# EAGLE design avatar2 (EAGLE 7.6.0)
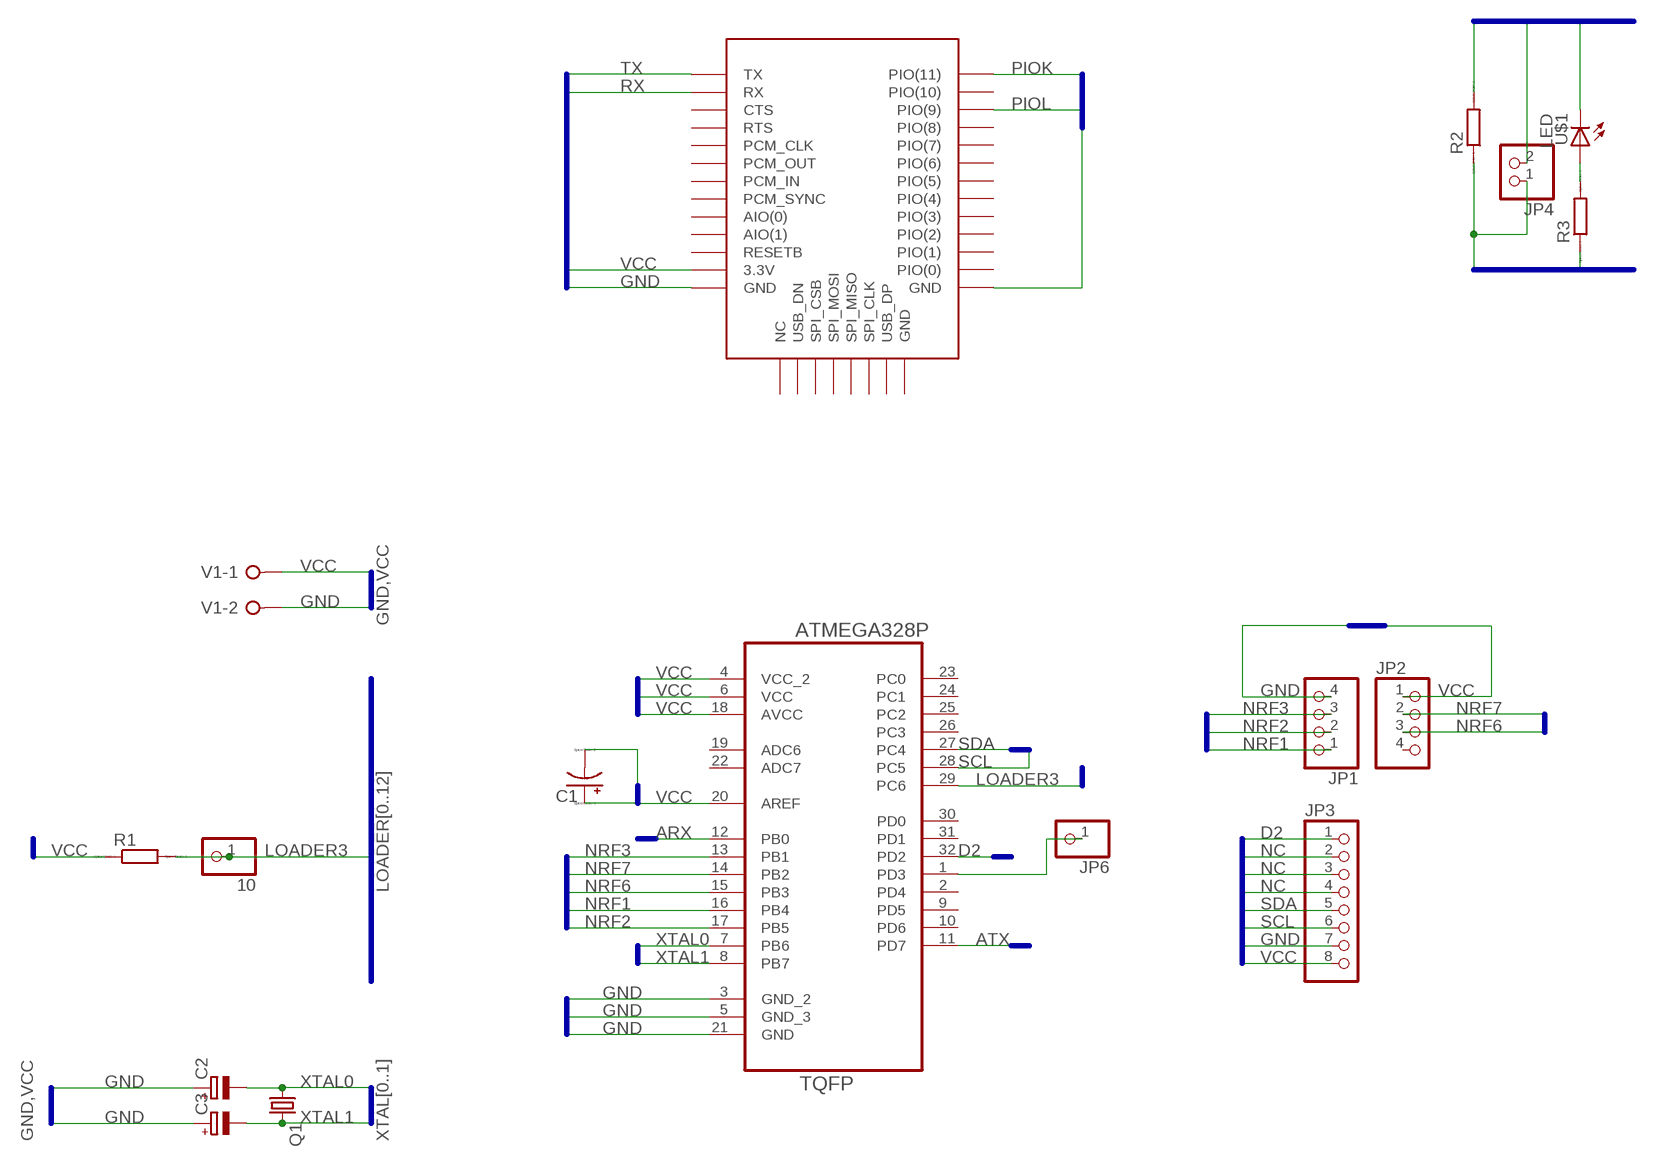
[diagram p0: schematic, sheet 1]

## Parts
10  PINHD-1X1  [1X01]
C1  CPOL-USTT5D7  [TT5D7]
C2  CPOL-EUE1.8-4  [E1,8-4]
C3  CPOL-EUE1.8-4  [E1,8-4]
IC1  BC04_BLUETOOTH  [BC04]
JP1  PINHD-1X4  [1X04]
JP2  PINHD-1X4  [1X04]
JP3  PINHD-1X8  [1X08]
JP4  PINHD-1X2  [1X02]
JP6  PINHD-1X1  [1X01]
Q1  CRYSTALHC49U-V  [HC49U-V]
R1  R0207/10  [0207/10]
R2  R0207/10  [0207/10]
R3  R0207/10  [0207/10]
U1  ATMEGA328P-AU  [QFP80P900X900X120-32N]
U$1  LED  [HLMP-1790]
V1  W237-02P  [W237-132]

## Nets
ARX: U1.12(PB0)
ATX: U1.11(PD7)
D2: JP3.1 U1.32(PD2)
GND: C1.- C2.+ C3.+ IC1.P$13(GND) IC1.P$22(GND) JP1.4 JP3.7 R2.2 U1.3(GND_2) U1.5(GND_3) U1.21(GND) U$1.C V1.2
LOADER3: 10.1 R1.2 U1.29(PC6)
N$1: R3.2 U$1.A
N$2: JP6.1 U1.1(PD3)
NC: JP3.2 JP3.3 JP3.4
NRF1: JP1.1 U1.16(PB4)
NRF2: JP1.2 U1.17(PB5)
NRF3: JP1.3 U1.13(PB1)
NRF6: JP2.3 U1.15(PB3)
NRF7: JP2.2 U1.14(PB2)
PIOK: IC1.P$34(PIO(11)) JP4.1 R2.1
PIOL: IC1.P$32(PIO(9)) R3.1
RX: IC1.P$2(RX)
SCL: JP3.6 U1.28(PC5)
SDA: JP3.5 U1.27(PC4)
TX: IC1.P$1(TX)
VCC: C1.+ IC1.P$12(3.3V) JP2.1 JP3.8 JP4.2 R1.1 U1.4(VCC_2) U1.6(VCC) U1.18(AVCC) U1.20(AREF) V1.1
XTAL0: C2.- Q1.1 U1.7(PB6)
XTAL1: C3.- Q1.2 U1.8(PB7)
Unconnected: IC1.P$3(CTS) IC1.P$4(RTS) IC1.P$5(PCM_CLK) IC1.P$6(PCM_OUT) IC1.P$7(PCM_IN) IC1.P$8(PCM_SYNC) IC1.P$9(AIO(0)) IC1.P$10(AIO(1)) IC1.P$11(RESETB) IC1.P$14(NC) IC1.P$15(USB_DN) IC1.P$16(SPI_CSB) IC1.P$17(SPI_MOSI) IC1.P$18(SPI_MISO) IC1.P$19(SPI_CLK) IC1.P$20(USB_DP) IC1.P$21(GND) IC1.P$23(PIO(0)) IC1.P$24(PIO(1)) IC1.P$25(PIO(2)) IC1.P$26(PIO(3)) IC1.P$27(PIO(4)) IC1.P$28(PIO(5)) IC1.P$29(PIO(6)) IC1.P$30(PIO(7)) IC1.P$31(PIO(8)) IC1.P$33(PIO(10)) JP2.4 U1.2(PD4) U1.9(PD5) U1.10(PD6) U1.19(ADC6) U1.22(ADC7) U1.23(PC0) U1.24(PC1) U1.25(PC2) U1.26(PC3) U1.30(PD0) U1.31(PD1)

## Buses
LOADER[0..12]
GND,VCC
XTAL[0..1]
NRF[1..8]
TX,RX,PIOK,PIOL,VCC,GND
ATX,ARX
D2,NC,SDA,SCL,GND,VCC

## Library data of the parts
10 JP6 = pinhead:PINHD-1X1: PIN HEADER
C1 = resistor:CPOL-US: POLARIZED CAPACITOR, American symbol
C2 C3 = rcl:CPOL-EU: POLARIZED CAPACITOR, European symbol
IC1 = bc04:BC04_BLUETOOTH; IC: BC04
JP1 JP2 = pinhead:PINHD-1X4: PIN HEADER
JP3 = pinhead:PINHD-1X8: PIN HEADER
JP4 = pinhead:PINHD-1X2: PIN HEADER
Q1 = crystal:CRYSTAL: CRYSTAL; OC_FARNELL: 1666969; OC_NEWARK: unknown
R1-R3 = eagle-ltspice:R: RESISTOR, European symbol; SPICEMODEL: NONE; SPICEPREFIX: R
U1 = Ava:ATMEGA328P-AU; DESCRIPTION: 8-bit Microcontroller with In-System Programmable Flash; MPN: ATMEGA328P-AU; OC_FARNELL: 1715486; OC_NEWARK: 14R4631; PACKAGE: TQFP-32; SUPPLIER: Atmel
U$1 = Ava:LED
V1 = con-wago-508:W237-02P: WAGO SREW CLAMP; OC_FARNELL: unknown; OC_NEWARK: unknown

## Board
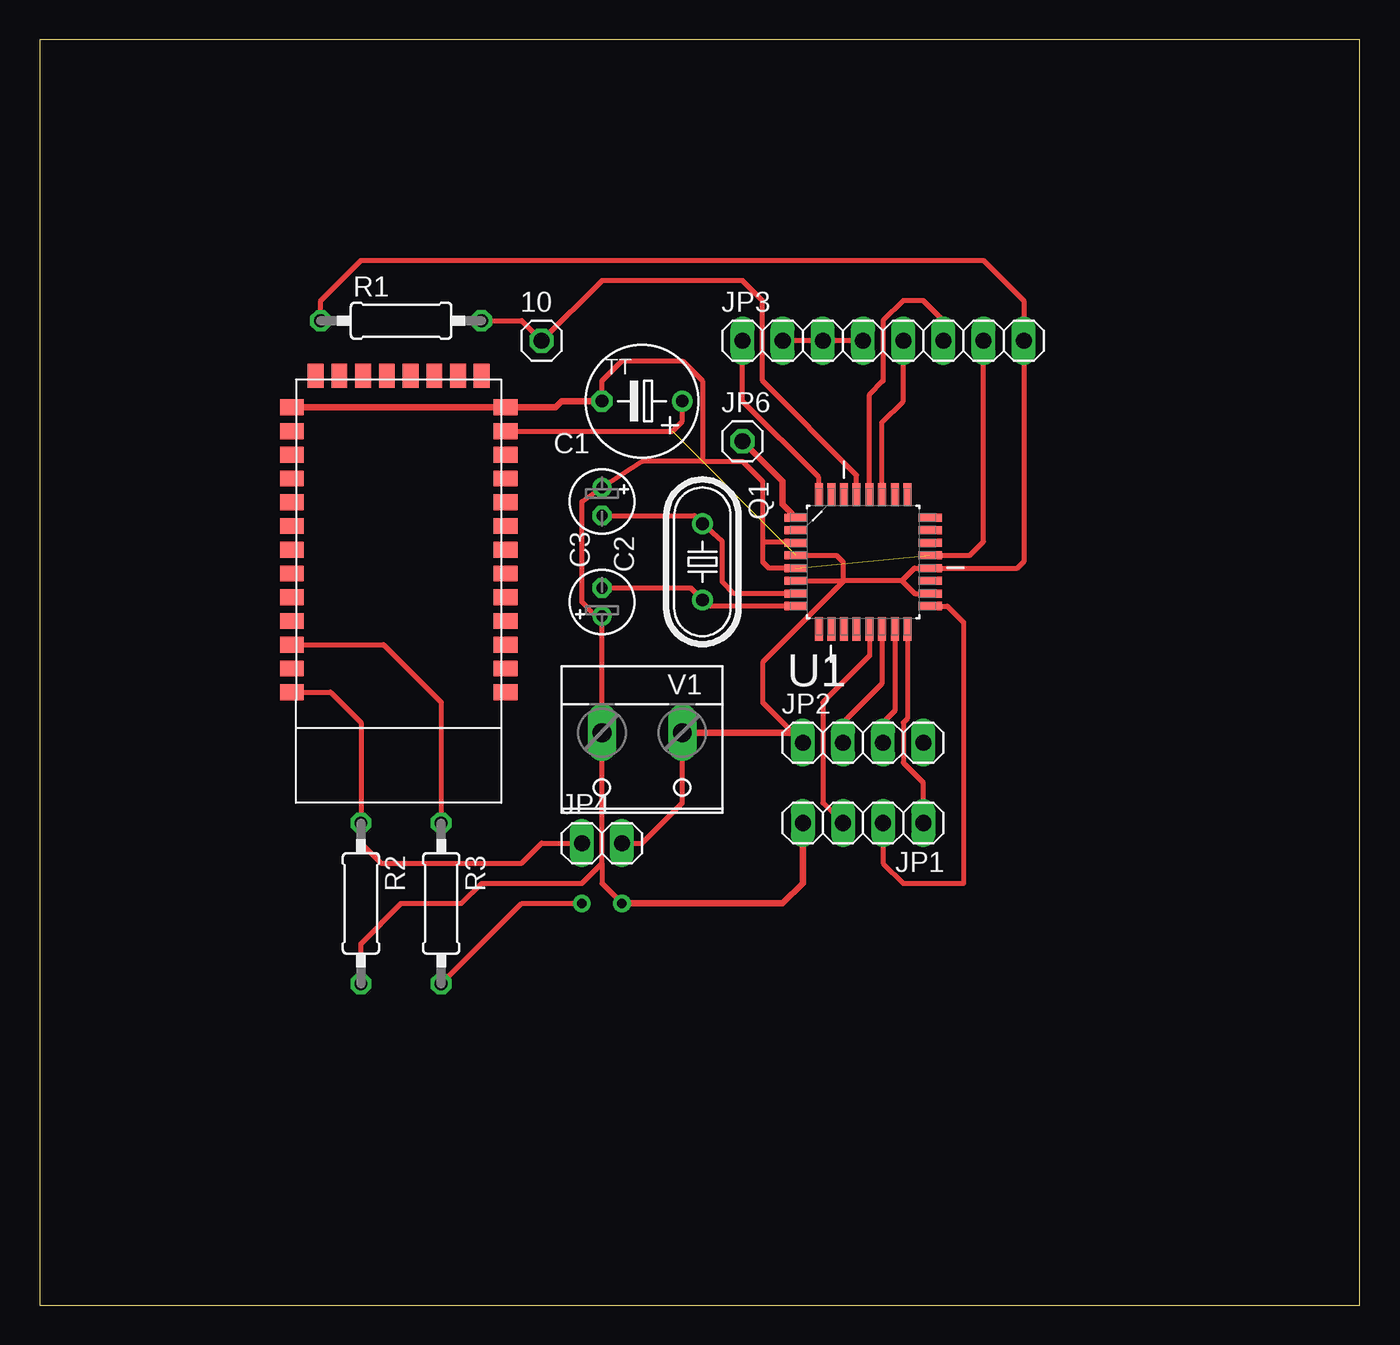
[diagram p1: board, top side]
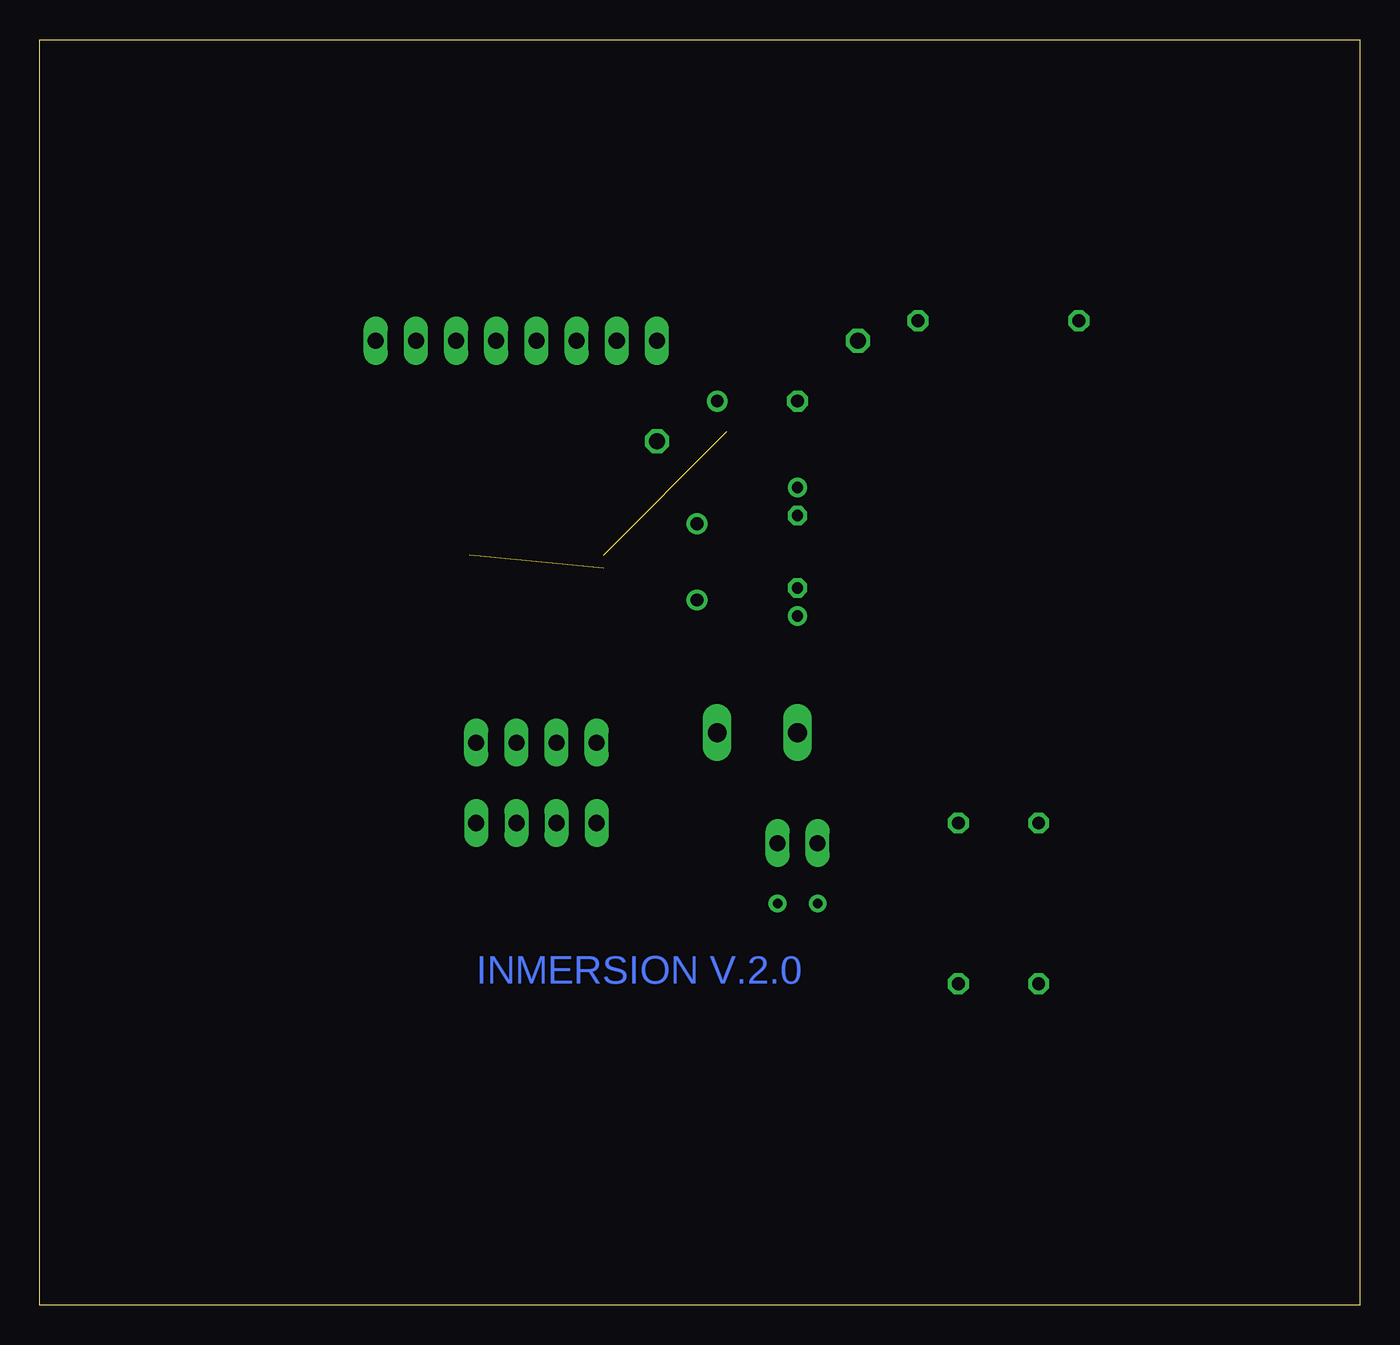
[diagram p2: board, bottom side, seen from below]

Size 83.49 x 80 mm. Coordinates in mm from the lower left corner, seen from the top.
Outline: 0,0 83.49,0 83.49,80 0,80 0,0
Copper layers (1*16): Top 0.035mm / dielectric 1.5mm / Bottom 0.035mm
Design rules "default": minimum track width 10mil, minimum drill 24mil, track to track 8mil, track to pad 8mil, pad to pad 8mil, via to via 8mil, smd to smd 8mil, copper to edge 40mil, drill to drill 8mil, minimum pad ring 10mil, minimum via ring 8mil, stop-mask expansion 4mil, vias tented up to drill 0mil, thermal gap 10mil

### Footprints (pad centres in the part's own frame; a part is rotated, then mirrored left to right if it is on the bottom)
1X01 = drill 1.016 octagon: 1 0,0
TT5D7 = drill 0.813: + -2.54,0 | drill 0.813 octagon: - 2.54,0
E1,8-4 = drill 0.711 pad 1.168: + -0.889,0 | drill 0.711 pad 1.168 octagon: - 0.889,0
BC04 = smd 1 x 1.5: P$1 7,-0.25; P$2 8.5,-0.25; P$3 10,-0.25; P$4 11.5,-0.25; P$5 13,-0.25; P$6 14.5,-0.25; P$7 16,-0.25; P$8 17.5,-0.25; P$9 19,-0.25; P$10 20.5,-0.25; P$11 22,-0.25; P$12 23.5,-0.25; P$13 25,-0.25; P$22 25,13.25; P$23 23.5,13.25; P$24 22,13.25; P$25 20.5,13.25; P$26 19,13.25; P$27 17.5,13.25; P$28 16,13.25; P$29 14.5,13.25; P$30 13,13.25; P$31 11.5,13.25; P$32 10,13.25; P$33 8.5,13.25; P$34 7,13.25 | smd 1.5 x 1: P$14 27,1.25; P$15 27,2.75; P$16 27,4.25; P$17 27,5.75; P$18 27,7.25; P$19 27,8.75; P$20 27,10.25; P$21 27,11.75
1X04 = drill 1.016 long: 1 -3.81,0; 2 -1.27,0; 3 1.27,0; 4 3.81,0
1X08 = drill 1.016 long: 1 -8.89,0; 2 -6.35,0; 3 -3.81,0; 4 -1.27,0; 5 1.27,0; 6 3.81,0; 7 6.35,0; 8 8.89,0
1X02 = drill 1.016 long: 1 -1.27,0; 2 1.27,0
HC49U-V = drill 0.813: 1 -2.413,0; 2 2.413,0
0207/10 = drill 0.813 octagon: 1 -5.08,0; 2 5.08,0
QFP80P900X900X120-32N = smd 1.473 x 0.508: 1 -4.242,2.794; 2 -4.242,2.007; 3 -4.242,1.194; 4 -4.242,0.406; 5 -4.242,-0.406; 6 -4.242,-1.194; 7 -4.242,-2.007; 8 -4.242,-2.794; 17 4.242,-2.794; 18 4.242,-2.007; 19 4.242,-1.194; 20 4.242,-0.406; 21 4.242,0.406; 22 4.242,1.194; 23 4.242,2.007; 24 4.242,2.794 | smd 0.508 x 1.473: 9 -2.794,-4.242; 10 -2.007,-4.242; 11 -1.194,-4.242; 12 -0.406,-4.242; 13 0.406,-4.242; 14 1.194,-4.242; 15 2.007,-4.242; 16 2.794,-4.242; 25 2.794,4.242; 26 2.007,4.242; 27 1.194,4.242; 28 0.406,4.242; 29 -0.406,4.242; 30 -1.194,4.242; 31 -2.007,4.242; 32 -2.794,4.242
HLMP-1790 = drill 0.6: A -1.27,0; C 1.27,0
W237-132 = drill 1.194 long: 1 -2.54,-0.635; 2 2.54,-0.635

### Placement (x,y rotation side)
10  31.75,60.96 0 top
C1  38.1,57.15 180 top
C2  35.56,50.8 270 top
C3  35.56,44.45 90 top
IC1  29.21,31.75 90 top
JP1  52.07,30.48 180 top
JP2  52.07,35.56 0 top
JP3  53.34,60.96 0 top
JP4  35.56,29.21 0 top
JP6  44.45,54.61 0 top
Q1  41.91,46.99 270 top
R1  22.86,62.23 0 top
R2  20.32,25.4 270 top
R3  25.4,25.4 270 top
U1  52.07,46.99 0 top
U$1  35.56,25.4 0 top
V1  38.1,35.56 180 top

### Tracks (layer width: path | path; a pad name or v marks a point on that pad's centre or on a via)
D2
  Top 0.305: U1.32 49.28,52.32 44.45,57.15 JP3.1
GND  (1 unrouted)
  Top 0.305: U1.5 46.13,46.58 45.72,46.99 45.72,48.26 | U1.3 47.75,48.26 45.72,48.26 | 41.91,53.34 38.1,53.34 C2.+ 34.29,50.8 34.29,44.45 35.18,43.56 C3.+ V1.2 35.56,27.94 | 41.91,53.34 44.45,53.34 45.72,52.07 45.72,48.26 | JP3.7 59.69,48.26 58.83,47.4 U1.21 | C1.- 35.56,58.42 36.83,59.69 40.64,59.69 41.91,58.42 41.91,53.34 | 35.56,27.94 34.29,26.67 27.94,26.67 26.67,25.4 22.86,25.4 20.32,22.86 R2.2 | 35.56,27.94 35.56,26.67 U$1.C
  Top 0.406: IC1.P$22 IC1.P$13 32.62,56.75 33.02,57.15 C1.- | U$1.C 46.99,25.4 48.26,26.67 JP1.4
LOADER3
  Top 0.305: R1.2 30.48,62.23 10.1 35.56,64.77 44.45,64.77 45.72,63.5 45.72,58.42 51.66,52.48 U1.29
N$1
  Top 0.305: R3.2 30.48,25.4 U$1.A
N$2
  Top 0.406: JP6.1 46.99,52.07 46.99,50.62 U1.1
NC
  Top 0.305: JP3.2 JP3.3 JP3.4
NRF1
  Top 0.305: JP1.1 55.88,33.02 54.61,34.29 54.61,36.83 54.86,37.08 U1.16
NRF2
  Top 0.305: JP1.2 53.34,27.94 54.61,26.67 58.42,26.67 58.42,43.18 57.4,44.2 U1.17
NRF3
  Top 0.305: U1.13 52.48,41.05 49.53,38.1 49.53,31.75 JP1.3
NRF6
  Top 0.305: U1.15 54.08,37.57 53.34,36.83 JP2.3
NRF7
  Top 0.305: U1.14 53.26,39.29 50.8,36.83 JP2.2
PIOK
  Top 0.305: JP4.1 31.75,29.21 30.48,27.94 21.59,27.94 20.32,29.21 R2.1 20.32,36.83 18.4,38.75 IC1.P$34
PIOL
  Top 0.305: IC1.P$32 21.75,41.75 25.4,38.1 R3.1
SCL
  Top 0.305: U1.28 52.48,57.56 53.34,58.42 53.34,62.23 54.61,63.5 55.88,63.5 57.15,62.23 JP3.6
SDA
  Top 0.305: U1.27 53.26,55.8 54.61,57.15 JP3.5
VCC  (1 unrouted)
  Top 0.305: U1.18 55.35,44.98 54.53,45.8 | U1.6 50.8,45.8 | 54.53,45.8 50.8,45.8 | U1.4 50.39,47.4 50.8,46.99 50.8,45.8 | 54.53,45.8 55.32,46.58 U1.20 61.82,46.58 62.23,46.99 JP3.8 62.23,63.5 59.69,66.04 20.32,66.04 17.78,63.5 R1.1 | IC1.P$12 40.01,55.25 40.64,55.88 C1.+ | 50.8,45.8 50.8,45.72 45.72,40.64 45.72,38.1 JP2.1 | JP4.2 38.1,29.21 40.64,31.75 V1.1
  Top 0.406: V1.1 47.62,36.2 JP2.1
XTAL0
  Top 0.305: C2.- 41.4,49.91 Q1.1 43.18,48.26 43.18,45.72 43.92,44.98 U1.7
XTAL1
  Top 0.305: C3.- 41.15,45.34 Q1.2 42.29,44.2 U1.8

### Text on the board
Bottom: INMERSION V.2.0